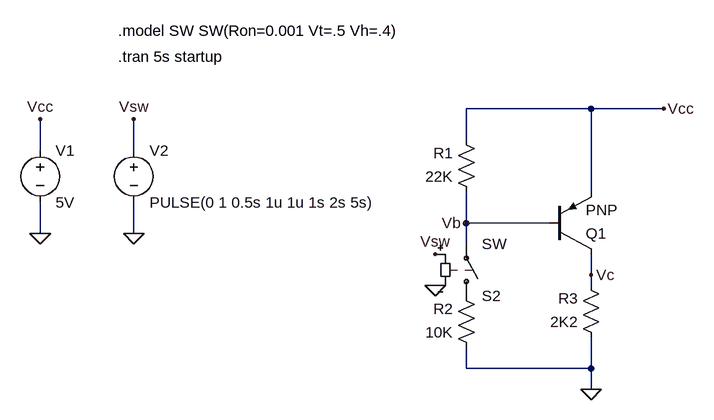
[diagram p0: schematic bjt-biasing-01.asc]
bjt-biasing-01.asc, the LTspice schematic file:
Version 4
SHEET 1 880 680
WIRE 32 -64 -160 -64
WIRE 144 -64 32 -64
WIRE -160 -16 -160 -64
WIRE -816 0 -816 -48
WIRE -672 0 -672 -48
WIRE 32 64 32 -64
WIRE -160 112 -160 64
WIRE -32 112 -160 112
WIRE -816 128 -816 80
WIRE -672 128 -672 80
WIRE -160 144 -160 112
WIRE 32 192 32 160
WIRE 32 208 32 192
WIRE -160 336 -160 304
WIRE 32 336 32 288
WIRE 32 336 -160 336
WIRE 32 368 32 336
FLAG -816 128 0
FLAG -816 -48 Vcc
FLAG -672 128 0
FLAG -672 -48 Vsw
FLAG 32 368 0
FLAG 144 -64 Vcc
FLAG -160 112 Vb
FLAG 32 192 Vc
FLAG -208 160 Vsw
FLAG -208 208 0
SYMBOL voltage -816 -16 R0
WINDOW 123 0 0 Left 0
WINDOW 39 0 0 Left 0
SYMATTR InstName V1
SYMATTR Value 5V
SYMBOL res -144 80 R180
WINDOW 0 36 76 Left 2
WINDOW 3 36 40 Left 2
SYMATTR InstName R1
SYMATTR Value 22K
SYMBOL voltage -672 -16 R0
WINDOW 123 0 0 Left 0
WINDOW 39 0 0 Left 0
SYMATTR InstName V2
SYMATTR Value PULSE(0 1 0.5s 1u 1u 1s 2s 5s)
SYMBOL pnp -32 160 M180
SYMATTR InstName Q1
SYMBOL res 48 304 R180
WINDOW 0 36 76 Left 2
WINDOW 3 36 40 Left 2
SYMATTR InstName R3
SYMATTR Value 2K2
SYMBOL res -144 320 R180
WINDOW 0 36 76 Left 2
WINDOW 3 36 40 Left 2
SYMATTR InstName R2
SYMATTR Value 10K
SYMBOL sw -160 240 M180
SYMATTR InstName S2
TEXT -696 -144 Left 2 !.tran 5s startup
TEXT -696 -184 Left 2 !.model SW SW(Ron=0.001 Vt=.5 Vh=.4)

The netlist it stands for:
* bjt-biasing-01.asc
V1 Vcc 0 5V
R1 Vb Vcc 22K
V2 Vsw 0 PULSE(0 1 0.5s 1u 1u 1s 2s 5s)
Q1 Vc Vb Vcc 0 PNP
R3 0 Vc 2K2
R2 0 P001 10K
S2 P001 Vb Vsw 0 SW
.model NPN NPN
.model PNP PNP
.lib standard.bjt
.tran 5s startup
.model SW SW(Ron=0.001 Vt=.5 Vh=.4)
.backanno
.end